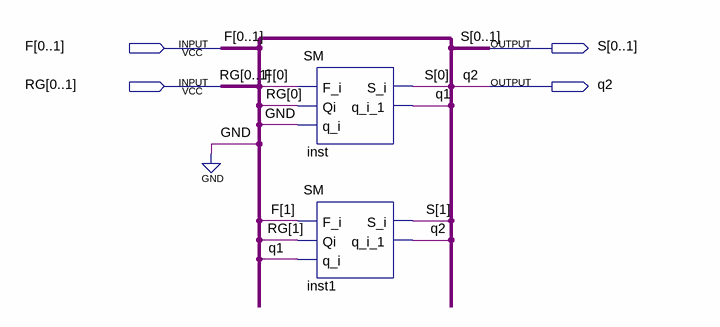
[diagram p0: schematic sheet]
// Quartus schematic SM2.bdf as structural Verilog: 2 symbols, 4 pins
module SM2 (
  input  [0:1] F,
  input  [0:1] RG,
  output [0:1] S,
  output q2
);

  wire q1;

  SM inst (.F_i(F[0]), .Qi(RG[0]), .q_i(1'b0), .S_i(S[0]), .q_i_1(q1));
  SM inst1 (.F_i(F[1]), .Qi(RG[1]), .q_i(q1), .S_i(S[1]), .q_i_1(q2));
endmodule
